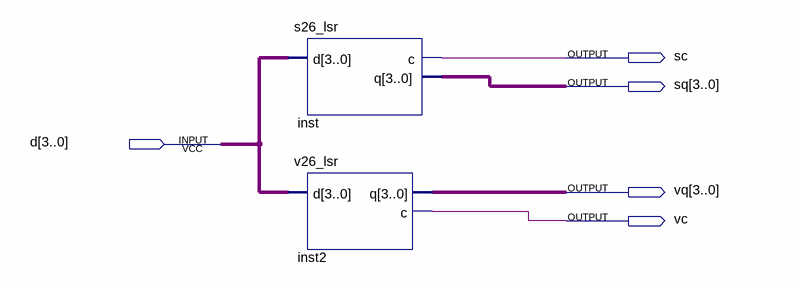
[diagram p0: schematic sheet]
// Quartus schematic sv26_lsr.bdf as structural Verilog: 2 symbols, 5 pins
module sv26_lsr (
  input  [3:0] d,
  output sc,
  output [3:0] sq,
  output [3:0] vq,
  output vc
);

  s26_lsr inst (.d(d), .c(sc), .q(sq));
  v26_lsr inst2 (.d(d), .q(vq), .c(vc));
endmodule
